# Altium schematic sheet SinWaveCal.SchDoc
size A4
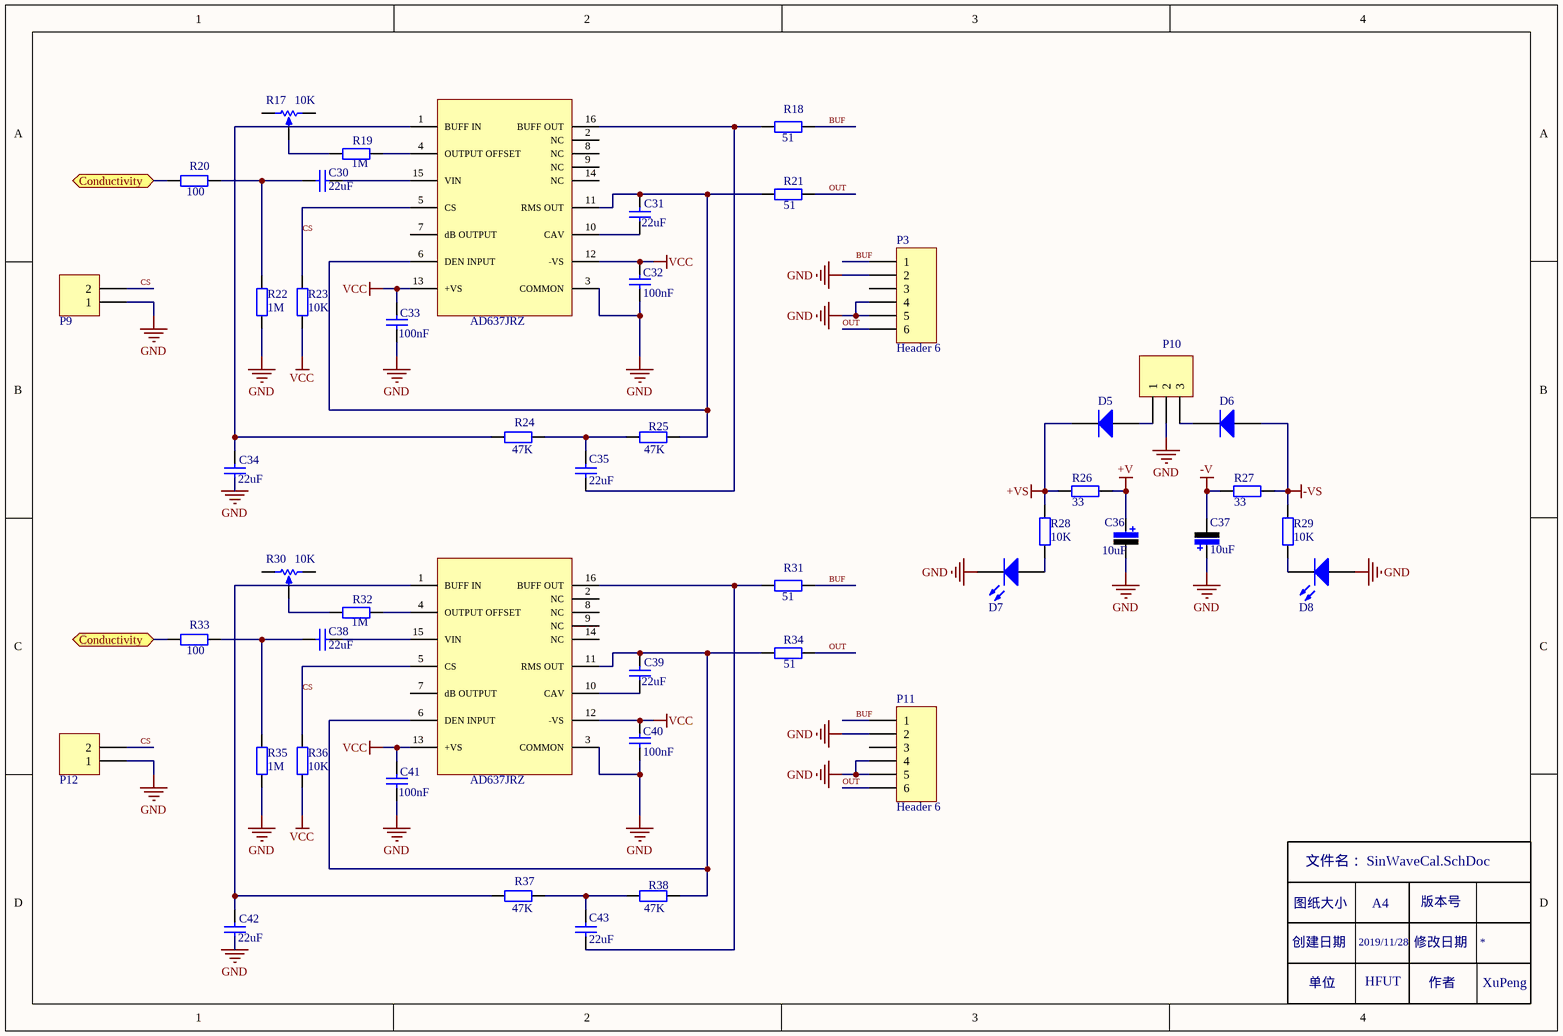
[diagram p0: SinWaveCal.SchDoc]

## Parts
(Parts that share a designator on the sheet are numbered #1, #2 ... from top to bottom, then left to right.)
AD?#1  AD637JRZ  [SOP16-50-208]
AD?#2  AD637JRZ  [SOP16-50-208]
C30  value 22uF  [C-RAD-0603]  (hidden comment: Cap)
C31  value 22uF  [C-RAD-0603]  (hidden comment: Cap)
C32  value 100nF  [C-RAD-0603]  (hidden comment: Cap)
C33  value 100nF  [C-RAD-0603]  (hidden comment: Cap)
C34  value 22uF  [C-RAD-0603]  (hidden comment: Cap)
C35  value 22uF  [C-RAD-0603]  (hidden comment: Cap)
C36  value 10uF  [CAP-3528]  (hidden comment: Cap Pol)
C37  value 10uF  [CAP-3528]  (hidden comment: Cap Pol)
C38  value 22uF  [C-RAD-0603]  (hidden comment: Cap)
C39  value 22uF  [C-RAD-0603]  (hidden comment: Cap)
C40  value 100nF  [C-RAD-0603]  (hidden comment: Cap)
C41  value 100nF  [C-RAD-0603]  (hidden comment: Cap)
C42  value 22uF  [C-RAD-0603]  (hidden comment: Cap)
C43  value 22uF  [C-RAD-0603]  (hidden comment: Cap)
D5  Diode  [DIODE-1206]  (value not drawn)
D6  Diode  [DIODE-1206]  (value not drawn)
D7  LED0  [LED_0805]  (value not drawn)
D8  LED0  [LED_0805]  (value not drawn)
P3  Header 6  [HDR6X1_B2]
P9  Header 2  [HDR2X1_A]  (value not drawn)
P10  Header 3  [HDR3X1_A]  (value not drawn)
P11  Header 6  [HDR6X1_B2]
P12  Header 2  [HDR2X1_A]  (value not drawn)
R17  value 10K  [VR_A1]  (hidden comment: RPot)
R18  value 51  [0603-1]  (hidden comment: Res1)
R19  value 1M  [0603-1]  (hidden comment: Res1)
R20  value 100  [0603-1]  (hidden comment: Res1)
R21  value 51  [0603-1]  (hidden comment: Res1)
R22  value 1M  [0603-1]  (hidden comment: Res1)
R23  value 10K  [0603-1]  (hidden comment: Res1)
R24  value 47K  [0603-1]  (hidden comment: Res1)
R25  value 47K  [0603-1]  (hidden comment: Res1)
R26  value 33  [0603-1]  (hidden comment: Res1)
R27  value 33  [0603-1]  (hidden comment: Res1)
R28  value 10K  [0603-1]  (hidden comment: Res1)
R29  value 10K  [0603-1]  (hidden comment: Res1)
R30  value 10K  [VR_A1]  (hidden comment: RPot)
R31  value 51  [0603-1]  (hidden comment: Res1)
R32  value 1M  [0603-1]  (hidden comment: Res1)
R33  value 100  [0603-1]  (hidden comment: Res1)
R34  value 51  [0603-1]  (hidden comment: Res1)
R35  value 1M  [0603-1]  (hidden comment: Res1)
R36  value 10K  [0603-1]  (hidden comment: Res1)
R37  value 47K  [0603-1]  (hidden comment: Res1)
R38  value 47K  [0603-1]  (hidden comment: Res1)

## Ports
Conductivity

## Nets
+V: C36.1 R26.2
+VS: D5.2(K) R26.1 R28.1
-V: C37.2 R27.1
-VS: D6.1(A) R27.2 R29.1
GND: AD?#1.3(COMMON) AD?#2.3(COMMON) C32.1 C33.1 C34.1 C36.2 C37.1 C40.1 C41.1 C42.1 D7.2(K) D8.1(A) P3.2 P3.4 P3.5 P9.1 P10.2 P11.2 P11.4 P11.5 P12.1 R22.1 R35.1
VCC: AD?#1.12(-VS) AD?#1.13(+VS) AD?#2.12(-VS) AD?#2.13(+VS) C32.2 C33.2 C40.2 C41.2 R23.1 R36.1
BUF: P3.1 P11.1 R18.1 R31.1
Conductivity: R20.2 R33.2 ; port Conductivity
CS: AD?#1.5(CS) AD?#2.5(CS) P9.2 P12.2 R23.2 R36.2
OUT: P3.6 P11.6 R21.1 R34.1
NetAD?#1_1: AD?#1.1(BUFF_IN) C34.2 R24.2
NetAD?#1_4: AD?#1.4(OUTPUT_OFFSET) R19.2
NetAD?#1_6: AD?#1.6(DEN_INPUT) AD?#1.11(RMS_OUT) C31.2 R21.2 R25.1
NetAD?#1_10: AD?#1.10(CAV) C31.1
NetAD?#1_15: AD?#1.15(VIN) C30.2
NetAD?#1_16: AD?#1.16(BUFF_OUT) C35.1 R18.2
NetAD?#2_1: AD?#2.1(BUFF_IN) C42.2 R37.2
NetAD?#2_4: AD?#2.4(OUTPUT_OFFSET) R32.2
NetAD?#2_6: AD?#2.6(DEN_INPUT) AD?#2.11(RMS_OUT) C39.2 R34.2 R38.1
NetAD?#2_10: AD?#2.10(CAV) C39.1
NetAD?#2_15: AD?#2.15(VIN) C38.2
NetAD?#2_16: AD?#2.16(BUFF_OUT) C43.1 R31.2
NetC30_1: C30.1 R20.1 R22.2
NetC35_2: C35.2 R24.1 R25.2
NetC38_1: C38.1 R33.1 R35.2
NetC43_2: C43.2 R37.1 R38.2
NetD5_1: D5.1(A) P10.1
NetD6_2: D6.2(K) P10.3
NetD7_1: D7.1(A) R28.2
NetD8_2: D8.2(K) R29.2
NetR17_2: R17.2(TAP) R19.1
NetR30_2: R30.2(TAP) R32.1

Not connected (* = marked no-connect by the designer): AD?#1 2(NC) 7(dB_OUTPUT) 8(NC) 9(NC) 14(NC); AD?#2 2(NC) 7(dB_OUTPUT) 8(NC) 9(NC) 14(NC); P3 3; P11 3; R17 1(TOP) 3(BOT); R30 1(TOP) 3(BOT)

## Notes on the sheet
- 图纸大小
- 文件名：
- A4
- 版本号
- 创建日期
- 单位
- 2019/11/28
- HFUT
- 修改日期
- 作者
- XuPeng

## Library data of the parts
C30-C35 C38-C43 = Cap: 无极性电容; Published: 8-Jun-2000; LatestRevisionDate: 17-Jul-2002; LatestRevisionNote: Re-released for DXP Platform.; PackageReference: RAD-0.3; Publisher: Altium Limited
C36 C37 = Cap Pol: 极性电解电容; Vol: 16V; Published: 8-Jun-2000; LatestRevisionDate: 17-Jul-2002; LatestRevisionNote: Re-released for DXP Platform.; PackageReference: RB7.6-15; Publisher: Altium Limited
D5 D6 = Diode: 二极管; Type: 1N4001; Published: 8-Jun-2000; LatestRevisionDate: 17-Jul-2002; LatestRevisionNote: Re-released for DXP Platform.; PackageDocument: Sep-1996; PackageReference: SMC; Publisher: Altium Limited; Code_JEDEC: DO-214-AB
D7 D8 = LED0: 发光二极管; Published: 8-Jun-2000; LatestRevisionDate: 08-Jul-2005; LatestRevisionNote: Mech Layer 1 removed.; PackageReference: LED-0; Publisher: Altium Limited
P3 P11 = Header 6: 接插件; LatestRevisionDate: 17-Jul-2002; LatestRevisionNote: Re-released for DXP Platform.; Publisher: Altium Limited
P9 P12 = Header 2: 接插件; LatestRevisionDate: 17-Jul-2002; LatestRevisionNote: Re-released for DXP Platform.; Publisher: Altium Limited
P10 = Header 3: 接插件; LatestRevisionDate: 17-Jul-2002; LatestRevisionNote: Re-released for DXP Platform.; Publisher: Altium Limited
R17 R30 = RPot: 精密可调电阻; Sim Note: Enter the Resistance value and the set point into parameter fields.; Set Position: 0.5; Published: 8-Jun-2000; LatestRevisionDate: 17-Jul-2002; LatestRevisionNote: Re-released for DXP Platform.; PackageReference: VR5; Publisher: Altium Limited
R18-R29 R31-R38 = Res1: 贴片电阻; Published: 8-Jun-2000; LatestRevisionDate: 17-Jul-2002; LatestRevisionNote: Re-released for DXP Platform.; PackageReference: AXIAL-0.4; Publisher: Altium Limited